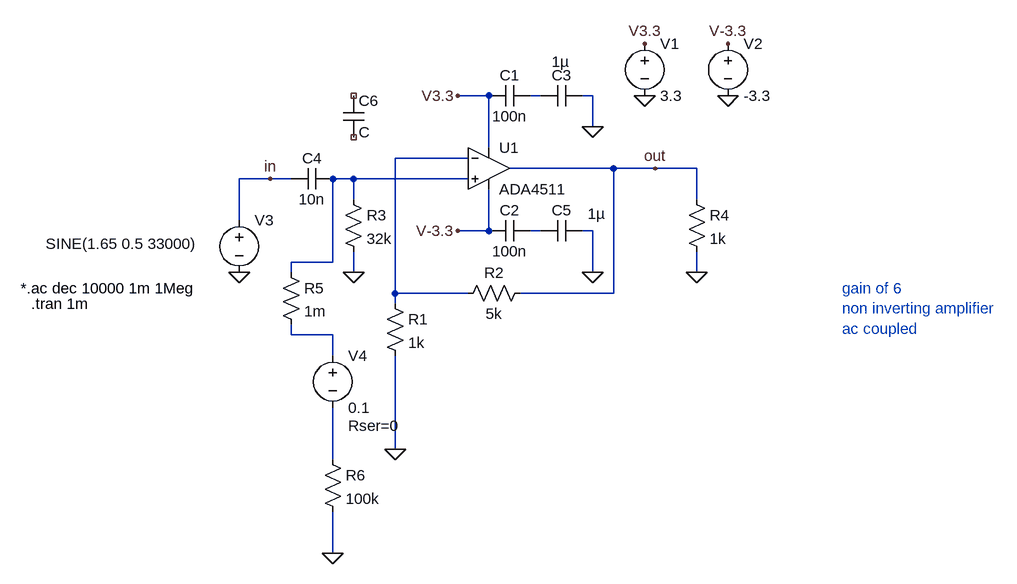
[diagram p0: schematic SpeakerSimulation - DC.asc]
SpeakerSimulation - DC.asc, the LTspice schematic file:
Version 4
SHEET 1 1052 932
WIRE 240 32 192 32
WIRE 320 32 304 32
WIRE 400 32 384 32
WIRE 400 80 400 32
WIRE 240 112 240 32
WIRE 208 128 96 128
WIRE 432 144 272 144
WIRE 496 144 432 144
WIRE 560 144 496 144
WIRE -96 160 -144 160
WIRE -64 160 -96 160
WIRE 32 160 0 160
WIRE 208 160 32 160
WIRE 32 192 32 160
WIRE 560 192 560 144
WIRE -144 224 -144 160
WIRE 240 240 240 176
WIRE 240 240 192 240
WIRE 320 240 304 240
WIRE 400 240 384 240
WIRE 0 288 0 160
WIRE 0 288 -64 288
WIRE -64 304 -64 288
WIRE 32 304 32 272
WIRE 400 304 400 240
WIRE 560 304 560 272
WIRE 96 336 96 128
WIRE 208 336 96 336
WIRE 432 336 432 144
WIRE 432 336 288 336
WIRE 96 352 96 336
WIRE -64 400 -64 384
WIRE 0 400 -64 400
WIRE 0 432 0 400
WIRE 96 576 96 432
WIRE 0 592 0 512
WIRE 0 736 0 672
FLAG 480 32 0
FLAG 608 32 0
FLAG 480 -48 V3.3
FLAG 608 -48 V-3.3
FLAG 400 80 0
FLAG 400 304 0
FLAG 192 240 V-3.3
FLAG 192 32 V3.3
FLAG 496 144 out
FLAG 96 576 0
FLAG -144 304 0
FLAG 32 304 0
FLAG -96 160 in
FLAG 560 304 0
FLAG 0 736 0
SYMBOL OpAmps\\ADA4511 240 80 R0
SYMATTR InstName U1
SYMBOL voltage 480 -64 R0
WINDOW 123 0 0 Left 0
WINDOW 39 0 0 Left 0
SYMATTR InstName V1
SYMATTR Value 3.3
SYMBOL voltage 608 -64 R0
WINDOW 123 0 0 Left 0
WINDOW 39 0 0 Left 0
SYMATTR InstName V2
SYMATTR Value -3.3
SYMBOL cap 304 16 R90
WINDOW 0 0 32 VBottom 2
WINDOW 3 32 32 VTop 2
SYMATTR InstName C1
SYMATTR Value 100n
SYMBOL cap 304 224 R90
WINDOW 0 0 32 VBottom 2
WINDOW 3 32 32 VTop 2
SYMATTR InstName C2
SYMATTR Value 100n
SYMBOL res 80 336 R0
SYMATTR InstName R1
SYMATTR Value 1k
SYMBOL res 304 320 R90
WINDOW 0 0 56 VBottom 2
WINDOW 3 32 56 VTop 2
SYMATTR InstName R2
SYMATTR Value 5k
SYMBOL voltage -144 208 R0
WINDOW 3 -298 52 Left 2
WINDOW 123 -298 80 Left 2
WINDOW 39 0 0 Left 0
SYMATTR Value SINE(1.65 0.5 33000)
SYMATTR InstName V3
SYMBOL cap 0 144 R90
WINDOW 0 0 32 VBottom 2
WINDOW 3 32 32 VTop 2
SYMATTR InstName C4
SYMATTR Value 10n
SYMBOL res 16 176 R0
SYMATTR InstName R3
SYMATTR Value 32k
SYMBOL res 544 176 R0
SYMATTR InstName R4
SYMATTR Value 1k
SYMBOL cap 384 16 R90
WINDOW 0 0 32 VBottom 2
WINDOW 3 -52 34 VTop 2
SYMATTR InstName C3
SYMATTR Value 1µ
SYMBOL cap 384 224 R90
WINDOW 0 0 32 VBottom 2
WINDOW 3 -26 -22 VTop 2
SYMATTR InstName C5
SYMATTR Value 1µ
SYMBOL voltage 0 416 R0
WINDOW 123 0 0 Left 0
WINDOW 39 24 124 Left 2
SYMATTR SpiceLine Rser=0
SYMATTR InstName V4
SYMATTR Value 0.1
SYMBOL res -80 288 R0
SYMATTR InstName R5
SYMATTR Value 1m
SYMBOL res -16 576 R0
SYMATTR InstName R6
SYMATTR Value 100k
SYMBOL cap 16 32 R0
SYMATTR InstName C6
TEXT -480 328 Left 2 !*.ac dec 10000 1m 1Meg
TEXT -464 352 Left 2 !.tran 1m
TEXT 784 328 Left 2 ;gain of 6\nnon inverting amplifier\nac coupled

The netlist it stands for:
* SpeakerSimulation - DC.asc
XU1 N003 N002 V3.3 V-3.3 out ADA4511  ; pins In+ In- V+ V- OUT
V1 V3.3 0 3.3
V2 V-3.3 0 -3.3
C1 N001 V3.3 100n
C2 N004 V-3.3 100n
R1 N002 0 1k
R2 out N002 5k
V3 in 0 SINE(1.65 0.5 33000)
C4 N003 in 10n
R3 N003 0 32k
R4 out 0 1k
C3 0 N001 1µ
C5 0 N004 1µ
V4 N005 N006 0.1 Rser=0
R5 N003 N005 1m
R6 N006 0 100k
C6 NC_01 NC_02 C
*.ac dec 10000 1m 1Meg
.tran 1m
* gain of 6
* non inverting amplifier
* ac coupled
.backanno
.end